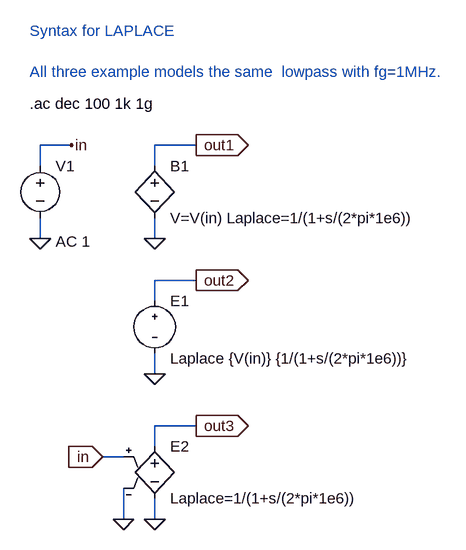
[diagram p0: schematic Laplace_syntax1.asc]
Laplace_syntax1.asc, the LTspice schematic file:
Version 4
SHEET 1 1088 724
WIRE -32 160 -32 128
WIRE -32 272 -32 240
WIRE 16 128 -32 128
WIRE 96 608 64 608
WIRE 96 704 96 656
WIRE 144 160 144 128
WIRE 144 272 144 240
WIRE 144 368 144 336
WIRE 144 480 144 448
WIRE 144 592 144 560
WIRE 144 704 144 672
WIRE 208 128 144 128
WIRE 208 336 144 336
WIRE 208 560 144 560
FLAG 144 272 0
FLAG 208 128 out1
IOPIN 208 128 Out
FLAG -32 272 0
FLAG 16 128 in
FLAG 144 480 0
FLAG 208 336 out2
IOPIN 208 336 Out
FLAG 144 704 0
FLAG 208 560 out3
IOPIN 208 560 Out
FLAG 64 608 in
IOPIN 64 608 In
FLAG 96 704 0
SYMBOL bv 144 144 R0
SYMATTR InstName B1
SYMATTR Value V=V(in) Laplace=1/(1+s/(2*pi*1e6))
SYMBOL voltage -32 144 R0
WINDOW 123 24 132 Left 0
WINDOW 39 0 0 Left 0
SYMATTR InstName V1
SYMATTR Value ""
SYMATTR Value2 AC 1
SYMBOL Misc\\Epoly 144 352 R0
SYMATTR InstName E1
SYMATTR Value Laplace {V(in)} {1/(1+s/(2*pi*1e6))}
SYMBOL e 144 576 R0
SYMATTR InstName E2
SYMATTR Value Laplace=1/(1+s/(2*pi*1e6))
TEXT -48 64 Left 0 !.ac dec 100 1k 1g
TEXT -48 -48 Left 0 ;Syntax for LAPLACE\n \nAll three example models the same  lowpass with fg=1MHz.

The netlist it stands for:
* Laplace_syntax1.asc
B1 out1 0 V=V(in) Laplace=1/(1+s/(2*pi*1e6))
V1 in 0 AC 1
E1 out2 0 Laplace {V(in)} {1/(1+s/(2*pi*1e6))}
E2 out3 0 in 0 Laplace=1/(1+s/(2*pi*1e6))
.ac dec 100 1k 1g
* Syntax for LAPLACE
* All three example models the same  lowpass with fg=1MHz.
.backanno
.end